# Altium schematic sheet 2.5V_regulator.SchDoc: 2.5V FPGA power supply
size A4; Author: L. Sartory; Organization: L. Sartory; Address2: Nixie clock; Address3: with GPS synchronization; DocumentNumber: 11; Revision: A1; SheetNumber: 11; SheetTotal: 14
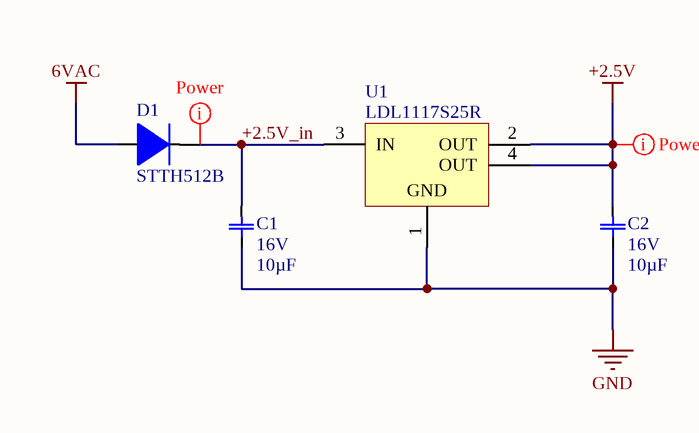
[diagram p0: 2.5V_regulator.SchDoc]

## Parts
C1  Voltage: 16V  [MLCC_1210]  (hidden comment: 10µF)
C2  Voltage: 16V  [MLCC_1210]  (hidden comment: 10µF)
D1  STTH512B  [STTH512B]
U1  LDL1117S25R  [TLV1117]

## Nets
6VAC: D1.A
+2.5V: C2.2 U1.2(OUT) U1.4(OUT)
GND: C1.1 C2.1 U1.1(GND)
+2.5V_in: C1.2 D1.K U1.3(IN)

## Layout directives
net class Power: +2.5V, +2.5V_in

## Notes on the sheet
- Title
- Size:
- Date:
- A4
- Number:
- Time:
- Revision:
- Sheet
- of
- File:

## Library data of the parts
C1 C2 = MLCC 10µF 16V 1210: Value: 10µF
D1 = STTH512B: Ultrafast recovery - 1200 V diode; HelpURL: https://datasheet.ciiva.com/6374/cd00096465-6374991.pdf
U1 = LDL1117S25R: Fixed LDO Voltage Regulator, 2.6 V to 18 V input, 75 mV Dropout, 2.5 V / 1.2 A out, SOT-223-4; Manufacturer: Texas Instruments; PartNumber: TLV1117LV25DCYT; Fixed Output Options(V): 2.5; Accuracy(%): 2; Iq(Typ)(mA): 0.05; Eco-Plan: Green (RoHS & no Sb/Br); Vdo(Typ)(mV): 1200; Iout(Max)(A): 1; Vin(Max)(V): 5.5; SubFamily: Single Channel LDO; ComponentLink3URL: http://www.ti.com/litv/pdf/mpds094a; DatasheetVersion: SBVS160A; PackageVersion: 4202506/B; Mounting Technology: Surface Mount; PackageDescription: 4-Pin Plastic Small Outline, Body 3.5 x 6.5 mm, Pitch 2.3 mm; ComponentLink2Description: Datasheet; ComponentLink3Description: Package Specification; ComponentLink2URL: http://www.ti.com/general/docs/lit/getliterature.tsp?genericPartNumber=TLV1117LV25&fileType=pdf; Code_JEDEC: TO-261; Vout Adj(Min)(V): 2.5; Vin(Min)(V): 2; PackageReference: DCY0004A; ComponentLink1Description: Manufacturer URL; ComponentLink1URL: http://www.ti.com/; Vout Adj(Max)(V): 2.5